# Altium schematic sheet VHDCI0_connector.SchDoc: VHDCI 0
size 420 x 297 mm; Author: G.K.; CompanyName: WUT; DrawnBy: G.K.; Organization: CERN; Address1: Warsaw Univeristy of Technology; Address2: Nowowiejska 15/19; DocumentNumber: 4; Revision: -; SheetNumber: 4; SheetTotal: 10; EDA_Number: ARTIQ; Projet: Banker; ModifiedBy: -; CreateDate: XX/XX/XXXX; CheckedDate: -; Title2: Connector & driver; DivGrp: ISE; Designer: G.K.; ModifiedDate: -; ProjectName: ADC/DAC MEZZANINE
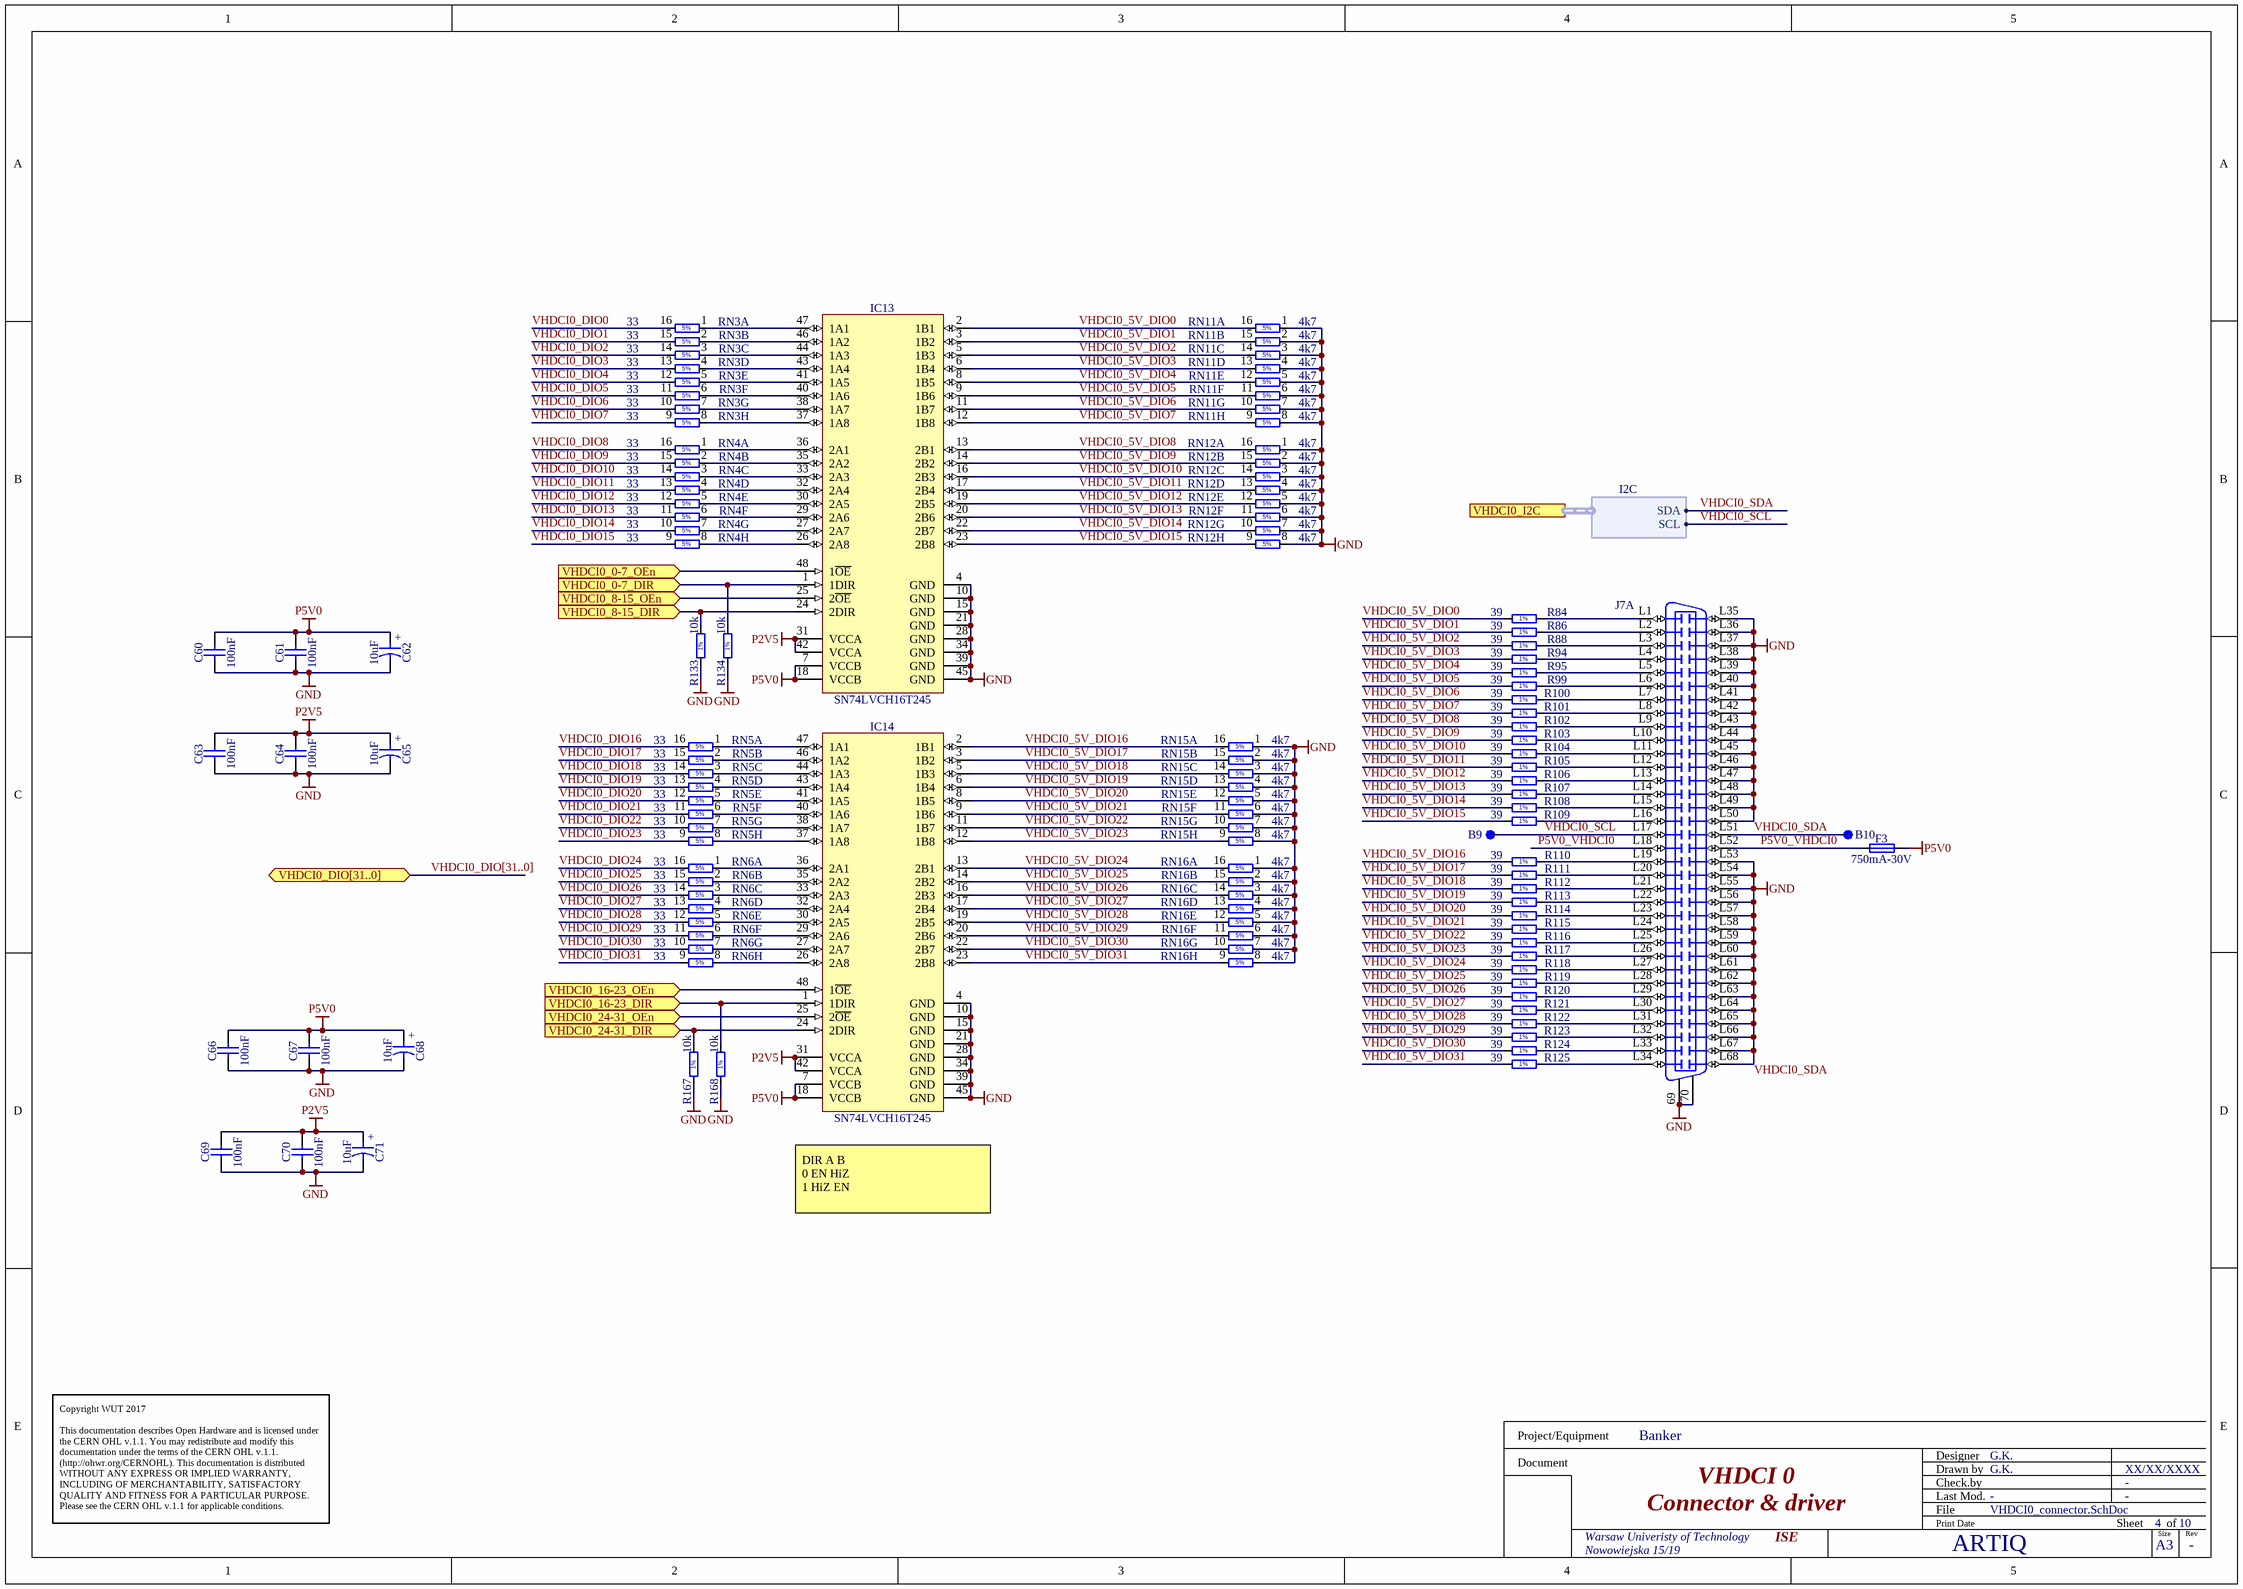
[diagram p0: VHDCI0_connector.SchDoc]

## Parts
B9  SMD Pad  [C100]  (value not drawn)
B10  SMD Pad  [C100]  (value not drawn)
C60  100nF  [CAPC1005X55N]
C61  100nF  [CAPC1005X55N]
C62  10uF  [CAPAE430X540N]
C63  100nF  [CAPC1005X55N]
C64  100nF  [CAPC1005X55N]
C65  10uF  [CAPAE430X540N]
C66  100nF  [CAPC1005X55N]
C67  100nF  [CAPC1005X55N]
C68  10uF  [CAPAE430X540N]
C69  100nF  [CAPC1005X55N]
C70  100nF  [CAPC1005X55N]
C71  10uF  [CAPAE430X540N]
F3  750mA-30V  [FUSR_BOURNS_MF-SM075]
IC13  SN74LVCH16T245  [SOP50P810X120-48N]
IC14  SN74LVCH16T245  [SOP50P810X120-48N]
J7  VHDCI  [MOLEX_74337-0015]  (value not drawn)  (part A of 2)
R84  39  [RESC2012X60N]
R86  39  [RESC2012X60N]
R88  39  [RESC2012X60N]
R94  39  [RESC2012X60N]
R95  39  [RESC2012X60N]
R99  39  [RESC2012X60N]
R100  39  [RESC2012X60N]
R101  39  [RESC2012X60N]
R102  39  [RESC2012X60N]
R103  39  [RESC2012X60N]
R104  39  [RESC2012X60N]
R105  39  [RESC2012X60N]
R106  39  [RESC2012X60N]
R107  39  [RESC2012X60N]
R108  39  [RESC2012X60N]
R109  39  [RESC2012X60N]
R110  39  [RESC2012X60N]
R111  39  [RESC2012X60N]
R112  39  [RESC2012X60N]
R113  39  [RESC2012X60N]
R114  39  [RESC2012X60N]
R115  39  [RESC2012X60N]
R116  39  [RESC2012X60N]
R117  39  [RESC2012X60N]
R118  39  [RESC2012X60N]
R119  39  [RESC2012X60N]
R120  39  [RESC2012X60N]
R121  39  [RESC2012X60N]
R122  39  [RESC2012X60N]
R123  39  [RESC2012X60N]
R124  39  [RESC2012X60N]
R125  39  [RESC2012X60N]
R133  10k  [RESC1005X40N]
R134  10k  [RESC1005X40N]
R167  10k  [RESC1005X40N]
R168  10k  [RESC1005X40N]
RN3  33  [RN_YAGEO_YC248]  (parts A,B,C,D,E,F,G,H of 8)
RN4  33  [RN_YAGEO_YC248]  (parts A,B,C,D,E,F,G,H of 8)
RN5  33  [RN_YAGEO_YC248]  (parts A,B,C,D,E,F,G,H of 8)
RN6  33  [RN_YAGEO_YC248]  (parts A,B,C,D,E,F,G,H of 8)
RN11  4k7  [RN_YAGEO_YC248]  (parts A,B,C,D,E,F,G,H of 8)
RN12  4k7  [RN_YAGEO_YC248]  (parts A,B,C,D,E,F,G,H of 8)
RN15  4k7  [RN_YAGEO_YC248]  (parts A,B,C,D,E,F,G,H of 8)
RN16  4k7  [RN_YAGEO_YC248]  (parts A,B,C,D,E,F,G,H of 8)

## Ports
VHDCI0_0-7_DIR (in), VHDCI0_0-7_OEn (in), VHDCI0_8-15_DIR (in), VHDCI0_8-15_OEn (in), VHDCI0_16-23_DIR (in), VHDCI0_16-23_OEn (in), VHDCI0_24-31_DIR (in), VHDCI0_24-31_OEn (in), VHDCI0_DIO[31..0] (bidir), VHDCI0_I2C (harness I2C)

## Harnesses
I2C: SDA, SCL

## Nets
GND: C60.1 C61.1 C62.2 C63.1 C64.1 C65.2 C66.1 C67.1 C68.2 C69.1 C70.1 C71.2 IC13.4(GND) IC13.10(GND) IC13.15(GND) IC13.21(GND) IC13.28(GND) IC13.34(GND) IC13.39(GND) IC13.45(GND) IC14.4(GND) IC14.10(GND) IC14.15(GND) IC14.21(GND) IC14.28(GND) IC14.34(GND) IC14.39(GND) IC14.45(GND) J7.69 J7.70 J7.L35 J7.L36 J7.L37 J7.L38 J7.L39 J7.L40 J7.L41 J7.L42 J7.L43 J7.L44 J7.L45 J7.L46 J7.L47 J7.L48 J7.L49 J7.L50 J7.L53 J7.L54 J7.L55 J7.L56 J7.L57 J7.L58 J7.L59 J7.L60 J7.L61 J7.L62 J7.L63 J7.L64 J7.L65 J7.L66 J7.L67 J7.L68 R133.1 R134.1 R167.1 R168.1 RN11.1 RN11.2 RN11.3 RN11.4 RN11.5 RN11.6 RN11.7 RN11.8 RN12.1 RN12.2 RN12.3 RN12.4 RN12.5 RN12.6 RN12.7 RN12.8 RN15.1 RN15.2 RN15.3 RN15.4 RN15.5 RN15.6 RN15.7 RN15.8 RN16.1 RN16.2 RN16.3 RN16.4 RN16.5 RN16.6 RN16.7 RN16.8
P2V5: C63.2 C64.2 C65.1 C69.2 C70.2 C71.1 IC13.31(VCCA) IC13.42(VCCA) IC14.31(VCCA) IC14.42(VCCA)
P5V0: C60.2 C61.2 C62.1 C66.2 C67.2 C68.1 F3.2 IC13.7(VCCB) IC13.18(VCCB) IC14.7(VCCB) IC14.18(VCCB)
P5V0_VHDCI0: F3.1 J7.L18 J7.L52
VHDCI0_0-7_DIR: IC13.1(1DIR) R134.2 ; port VHDCI0_0-7_DIR
VHDCI0_0-7_OEn: IC13.48(1~{OE}) ; port VHDCI0_0-7_OEn
VHDCI0_5V_DIO0: IC13.2(1B1) R84.1 RN11.16
VHDCI0_5V_DIO1: IC13.3(1B2) R86.1 RN11.15
VHDCI0_5V_DIO2: IC13.5(1B3) R88.1 RN11.14
VHDCI0_5V_DIO3: IC13.6(1B4) R94.1 RN11.13
VHDCI0_5V_DIO4: IC13.8(1B5) R95.1 RN11.12
VHDCI0_5V_DIO5: IC13.9(1B6) R99.1 RN11.11
VHDCI0_5V_DIO6: IC13.11(1B7) R100.1 RN11.10
VHDCI0_5V_DIO7: IC13.12(1B8) R101.1 RN11.9
VHDCI0_5V_DIO8: IC13.13(2B1) R102.1 RN12.16
VHDCI0_5V_DIO9: IC13.14(2B2) R103.1 RN12.15
VHDCI0_5V_DIO10: IC13.16(2B3) R104.1 RN12.14
VHDCI0_5V_DIO11: IC13.17(2B4) R105.1 RN12.13
VHDCI0_5V_DIO12: IC13.19(2B5) R106.1 RN12.12
VHDCI0_5V_DIO13: IC13.20(2B6) R107.1 RN12.11
VHDCI0_5V_DIO14: IC13.22(2B7) R108.1 RN12.10
VHDCI0_5V_DIO15: IC13.23(2B8) R109.1 RN12.9
VHDCI0_5V_DIO16: IC14.2(1B1) R110.1 RN15.16
VHDCI0_5V_DIO17: IC14.3(1B2) R111.1 RN15.15
VHDCI0_5V_DIO18: IC14.5(1B3) R112.1 RN15.14
VHDCI0_5V_DIO19: IC14.6(1B4) R113.1 RN15.13
VHDCI0_5V_DIO20: IC14.8(1B5) R114.1 RN15.12
VHDCI0_5V_DIO21: IC14.9(1B6) R115.1 RN15.11
VHDCI0_5V_DIO22: IC14.11(1B7) R116.1 RN15.10
VHDCI0_5V_DIO23: IC14.12(1B8) R117.1 RN15.9
VHDCI0_5V_DIO24: IC14.13(2B1) R118.1 RN16.16
VHDCI0_5V_DIO25: IC14.14(2B2) R119.1 RN16.15
VHDCI0_5V_DIO26: IC14.16(2B3) R120.1 RN16.14
VHDCI0_5V_DIO27: IC14.17(2B4) R121.1 RN16.13
VHDCI0_5V_DIO28: IC14.19(2B5) R122.1 RN16.12
VHDCI0_5V_DIO29: IC14.20(2B6) R123.1 RN16.11
VHDCI0_5V_DIO30: IC14.22(2B7) R124.1 RN16.10
VHDCI0_5V_DIO31: IC14.23(2B8) R125.1 RN16.9
VHDCI0_8-15_DIR: IC13.24(2DIR) R133.2 ; port VHDCI0_8-15_DIR
VHDCI0_8-15_OEn: IC13.25(2~{OE}) ; port VHDCI0_8-15_OEn
VHDCI0_16-23_DIR: IC14.1(1DIR) R168.2 ; port VHDCI0_16-23_DIR
VHDCI0_16-23_OEn: IC14.48(1~{OE}) ; port VHDCI0_16-23_OEn
VHDCI0_24-31_DIR: IC14.24(2DIR) R167.2 ; port VHDCI0_24-31_DIR
VHDCI0_24-31_OEn: IC14.25(2~{OE}) ; port VHDCI0_24-31_OEn
VHDCI0_DIO0: RN3.16
VHDCI0_DIO1: RN3.15
VHDCI0_DIO2: RN3.14
VHDCI0_DIO3: RN3.13
VHDCI0_DIO4: RN3.12
VHDCI0_DIO5: RN3.11
VHDCI0_DIO6: RN3.10
VHDCI0_DIO7: RN3.9
VHDCI0_DIO8: RN4.16
VHDCI0_DIO9: RN4.15
VHDCI0_DIO10: RN4.14
VHDCI0_DIO11: RN4.13
VHDCI0_DIO12: RN4.12
VHDCI0_DIO13: RN4.11
VHDCI0_DIO14: RN4.10
VHDCI0_DIO15: RN4.9
VHDCI0_DIO16: RN5.16
VHDCI0_DIO17: RN5.15
VHDCI0_DIO18: RN5.14
VHDCI0_DIO19: RN5.13
VHDCI0_DIO20: RN5.12
VHDCI0_DIO21: RN5.11
VHDCI0_DIO22: RN5.10
VHDCI0_DIO23: RN5.9
VHDCI0_DIO24: RN6.16
VHDCI0_DIO25: RN6.15
VHDCI0_DIO26: RN6.14
VHDCI0_DIO27: RN6.13
VHDCI0_DIO28: RN6.12
VHDCI0_DIO29: RN6.11
VHDCI0_DIO30: RN6.10
VHDCI0_DIO31: RN6.9
VHDCI0_SCL: B9.1 J7.L17 ; port VHDCI0_I2C.SCL
VHDCI0_SDA: B10.1 J7.L51 ; port VHDCI0_I2C.SDA
NetIC13_26: IC13.26(2A8) RN4.8
NetIC13_27: IC13.27(2A7) RN4.7
NetIC13_29: IC13.29(2A6) RN4.6
NetIC13_30: IC13.30(2A5) RN4.5
NetIC13_32: IC13.32(2A4) RN4.4
NetIC13_33: IC13.33(2A3) RN4.3
NetIC13_35: IC13.35(2A2) RN4.2
NetIC13_36: IC13.36(2A1) RN4.1
NetIC13_37: IC13.37(1A8) RN3.8
NetIC13_38: IC13.38(1A7) RN3.7
NetIC13_40: IC13.40(1A6) RN3.6
NetIC13_41: IC13.41(1A5) RN3.5
NetIC13_43: IC13.43(1A4) RN3.4
NetIC13_44: IC13.44(1A3) RN3.3
NetIC13_46: IC13.46(1A2) RN3.2
NetIC13_47: IC13.47(1A1) RN3.1
NetIC14_26: IC14.26(2A8) RN6.8
NetIC14_27: IC14.27(2A7) RN6.7
NetIC14_29: IC14.29(2A6) RN6.6
NetIC14_30: IC14.30(2A5) RN6.5
NetIC14_32: IC14.32(2A4) RN6.4
NetIC14_33: IC14.33(2A3) RN6.3
NetIC14_35: IC14.35(2A2) RN6.2
NetIC14_36: IC14.36(2A1) RN6.1
NetIC14_37: IC14.37(1A8) RN5.8
NetIC14_38: IC14.38(1A7) RN5.7
NetIC14_40: IC14.40(1A6) RN5.6
NetIC14_41: IC14.41(1A5) RN5.5
NetIC14_43: IC14.43(1A4) RN5.4
NetIC14_44: IC14.44(1A3) RN5.3
NetIC14_46: IC14.46(1A2) RN5.2
NetIC14_47: IC14.47(1A1) RN5.1
NetJ7_L1: J7.L1 R84.2
NetJ7_L2: J7.L2 R86.2
NetJ7_L3: J7.L3 R88.2
NetJ7_L4: J7.L4 R94.2
NetJ7_L5: J7.L5 R95.2
NetJ7_L6: J7.L6 R99.2
NetJ7_L7: J7.L7 R100.2
NetJ7_L8: J7.L8 R101.2
NetJ7_L9: J7.L9 R102.2
NetJ7_L10: J7.L10 R103.2
NetJ7_L11: J7.L11 R104.2
NetJ7_L12: J7.L12 R105.2
NetJ7_L13: J7.L13 R106.2
NetJ7_L14: J7.L14 R107.2
NetJ7_L15: J7.L15 R108.2
NetJ7_L16: J7.L16 R109.2
NetJ7_L19: J7.L19 R110.2
NetJ7_L20: J7.L20 R111.2
NetJ7_L21: J7.L21 R112.2
NetJ7_L22: J7.L22 R113.2
NetJ7_L23: J7.L23 R114.2
NetJ7_L24: J7.L24 R115.2
NetJ7_L25: J7.L25 R116.2
NetJ7_L26: J7.L26 R117.2
NetJ7_L27: J7.L27 R118.2
NetJ7_L28: J7.L28 R119.2
NetJ7_L29: J7.L29 R120.2
NetJ7_L30: J7.L30 R121.2
NetJ7_L31: J7.L31 R122.2
NetJ7_L32: J7.L32 R123.2
NetJ7_L33: J7.L33 R124.2
NetJ7_L34: J7.L34 R125.2

## Buses and harness runs
bus VHDCI0_DIO[31..0] = port VHDCI0_DIO[31..0]

## Notes on the sheet
- (near IC14) DIR	A	B
  0	EN	HiZ
  1	HiZ	EN
- Copyright WUT 2017
  This documentation describes Open Hardware and is licensed under the CERN OHL v.1.1. You may redistribute and modify this documentation under the terms of the CERN OHL v.1.1. (http://ohwr.org/CERNOHL). This documentation is distributed WITHOUT ANY EXPRESS OR IMPLIED WARRANTY, INCLUDING OF MERCHANTABILITY, SATISFACTORY QUALITY AND FITNESS FOR A PARTICULAR PURPOSE. Please see the CERN OHL v.1.1 for applicable conditions.
- Labels drawn without touching a wire or pin: VHDCI0_SDA
- Project/Equipment
- Document
- Designer
- Drawn by
- Check.by
- File
- Last Mod.
- Print Date
- Sheet
- Size
- A3
- of
- Rev
- (in symbol CAE430-540_10UF_16V_20%) +
- (in symbol R0402_10K_1%_0.0625W_100PPM) 1%
- (in symbol R0805_39R_1%_0.125W_100PPM) 1%
- (in symbol RES_RN_4K7_YAGEO_YC248-JR-074K7L, part A) 5%
- (in symbol RES_RN_4K7_YAGEO_YC248-JR-074K7L, part B) 5%
- (in symbol RES_RN_4K7_YAGEO_YC248-JR-074K7L, part C) 5%
- (in symbol RES_RN_4K7_YAGEO_YC248-JR-074K7L, part D) 5%
- (in symbol RES_RN_4K7_YAGEO_YC248-JR-074K7L, part E) 5%
- (in symbol RES_RN_4K7_YAGEO_YC248-JR-074K7L, part F) 5%
- (in symbol RES_RN_4K7_YAGEO_YC248-JR-074K7L, part G) 5%
- (in symbol RES_RN_4K7_YAGEO_YC248-JR-074K7L, part H) 5%
- (in symbol RN_33R_YAGEO_YC248-JR-0733RL, part A) 5%
- (in symbol RN_33R_YAGEO_YC248-JR-0733RL, part B) 5%
- (in symbol RN_33R_YAGEO_YC248-JR-0733RL, part C) 5%
- (in symbol RN_33R_YAGEO_YC248-JR-0733RL, part D) 5%
- (in symbol RN_33R_YAGEO_YC248-JR-0733RL, part E) 5%
- (in symbol RN_33R_YAGEO_YC248-JR-0733RL, part F) 5%
- (in symbol RN_33R_YAGEO_YC248-JR-0733RL, part G) 5%
- (in symbol RN_33R_YAGEO_YC248-JR-0733RL, part H) 5%

## Library data of the parts
B9 B10 = SMD_PAD_D1MM: Through Hole Pad; Part Description: 1mm Diameter SMD Pad; Mounted: No; Part Number: SMD_PAD_D1MM; Component Kind: Standard (No BOM); Component Type: Standard (No BOM); Pin Count: 1; Family: SMD Pad; Socket: No; SMD: No; Sense: No; Status: None; ComponentHeight: 0mm; HelpURL: Undefined; Author: CERN DEM JLC; CreateDate: 10.10.2017; LatestRevisionDate: 10.10.2017; PackageDescription: 1mm Diameter SMD Pad
C60 C61 C63 C64 C66 C67 C69 C70 = CC0402_100NF_16V_10%_X5R: Non-polarised capacitor; Part Description: SMD Multilayer Chip Ceramic Capacitor; Manufacturer: GENERIC; Manufacturer1 Part Number: GRM155R61C104KA88D; Voltage: 16V; TC: X5R; Tolerance: ±10%; Part Number: CC0402_100NF_16V_10%_X5R; Component Kind: Standard; Component Type: Standard; Pin Count: 2; Value: 100nF; Status: None; Manufacturer Part Number: CC0402_100NF_16V_10%_X5R; Case: 0402; Mounted: Yes; Socket: No; SMD: Yes; Sense: No; Manufacturer1 Example: MURATA; Manufacturer1 ComponentHeight: 0.55mm; HelpURL: \\cern.ch\dfs\Applications\Altium\Datasheets\CC0402_X5R_MURATA_GRM.pdf; Author: CERN DEM JLC; CreateDate: 10.12.2013; LatestRevisionDate: 10.12.2013
C62 C65 C68 C71 = CAE430-540_10UF_16V_20%: Polarised capacitor; Part Description: Aluminum Electrolytic SMT Capacitor; Manufacturer: PANASONIC; Manufacturer Part Number: EEEFK1C100AR; Voltage: 16V; Tolerance: ±20%; Part Number: CAE430-540_10UF_16V_20%; Component Kind: Standard; Component Type: Standard; Pin Count: 2; Value: 10uF; Status: Not Recommended; Case: B; Mounted: Yes; Socket: No; SMD: Yes; Sense: No; ComponentHeight: 5.8mm; HelpURL: \\cern.ch\dfs\Applications\Altium\Datasheets\CAE_PANASONIC_FK.pdf; Author: CERN DEM JLC; CreateDate: 03.12.2007; LatestRevisionDate: 05.11.2014
F3 = FUSR_BOURNS_MF-SM075-2: Fuse; Part Description: PTC Resettable Fuse; Manufacturer: BOURNS; PressFit: No; Part Number: FUSR_BOURNS_MF-SM075-2; Component Kind: Standard; Component Type: Standard; Pin Count: 2; PackageDescription: PolySwitch, 2-Leads, Body 7.35x5.12mm Nominal; Family: Fuses Resettable; Mounted: Yes; Socket: No; SMD: Yes; Sense: No; Value: 750mA-30V; Manufacturer Part Number: MF-SM075-2; ComponentHeight: 3.18mm; HelpURL: \\cern.ch\dfs\Applications\Altium\Datasheets\FUSR_BOURNS_MF-SM075-2.pdf; Author: CERN DEM JLC; CreateDate: 01/03/2012; LatestRevisionDate: 07/11/2012
IC13 IC14 = 74LVCH16T245: 16-Bit Dual-Supply Bus Transceiver With Configurable Voltage Translation And 3-State Outputs; Part Number: SN74LVCH16T245DGGR; Part Description: 16-Bit Dual-Supply Bus Transceivers With Configurable Voltage Translation And 3-State Outputs; Manufacturer: TEXAS INSTRUMENTS; PressFit: No; Bonding: No; Component Kind: Standard; Component Type: Standard; Device: SN74LVCH16T245; PackageDescription: SOP, 48-Leads, Body 12.6x6.2mm (max), Pitch 0.50mm, IPC Medium Density; Manufacturer Part Number: SN74LVCH16T245DGGR; Pin Count: 48; Case: TSSOP48; Mounted: Yes; Socket: No; SMD: Yes; Sense: No; ComponentHeight: 1.2mm; Author: GK; HelpURL: \\cern.ch\dfs\Applications\Altium\Datasheets\CLVCH16T245MDGGREP.pdf; CreateDate: 09/02/2016; LatestRevisionDate: 09/02/2016
J7 = MOLEX_74337-0015: Very High Density Cable Interconnect (VHDCI ) 2x68 Female; Part Number: Delivered by GK; Part Description: 2x68 Positions, Pitch 0.8mm, Very Hight Density Right Angle Dual Stacked VHDCI Receptacle; Manufacturer: MOLEX; PressFit: No; Component Kind: Standard; Component Type: Standard; Pin Count: 140; Family: VHDCI; Mounted: Yes; Socket: No; SMD: No; Sense: No; Status: None; Manufacturer Part Number: Delivered by GK; ComponentHeight: 10.78mm; HelpURL: \\cern.ch\dfs\Applications\Altium\Datasheets\MOLEX_74337-0015.pdf; Author: CERN DEM JLC; CreateDate: 30.04.2014; LatestRevisionDate: 30.04.2014
R84 R86 R88 R94 R95 R99-R125 = R0805_39R_1%_0.125W_100PPM: Resistor - 1%; Part Description: General Purpose Thick Film Chip Resistor; Manufacturer: GENERIC; Manufacturer1 Part Number: NRC10F39R0TRF; Power: 0.125W; TC: ±100ppm/°C; PressFit: No; Part Number: R0805_39R_1%_0.125W_100PPM; Component Kind: Standard; Component Type: Standard; Pin Count: 2; Value: 39; Status: Preferred; Tolerance: ±1%; Manufacturer Part Number: R0805_39R_1%_0.125W_100PPM; Case: 0805; Mounted: Yes; Sense: No; Socket: No; SMD: Yes; Manufacturer1 Example: NIC COMPONENT; Manufacturer1 ComponentHeight: 0.6mm; HelpURL: \\cern.ch\dfs\Applications\Altium\Datasheets\R0805_NIC_NRC.pdf; Author: CERN DEM JLC; CreateDate: 03/12/2007; LatestRevisionDate: 13/03/2008
R133 R134 R167 R168 = R0402_10K_1%_0.0625W_100PPM: Resistor - 1%; Part Description: General Purpose Thick Film Chip Resistor; Manufacturer: GENERIC; Manufacturer1 Part Number: 232270671003L; TC: ±100ppm/°C; PressFit: No; Part Number: R0402_10K_1%_0.0625W_100PPM; Component Kind: Standard; Component Type: Standard; Pin Count: 2; Value: 10k; Status: Not Recommended; Power: 0.0625W; Tolerance: ±1%; Manufacturer Part Number: R0402_10K_1%_0.0625W_100PPM; Case: 0402; Mounted: Yes; Sense: No; Socket: No; SMD: Yes; Manufacturer1 Example: YAGEO PHYCOMP; Manufacturer1 ComponentHeight: 0.4mm; HelpURL: \\cern.ch\dfs\Applications\Altium\Datasheets\R0402_Phycomp_RC0402.pdf; Author: CERN DEM JLC; CreateDate: 03/12/2007; LatestRevisionDate: 17/10/2012
RN3-RN6 = RN_33R_YAGEO_YC248-JR-0733RL: DIL16 Resistor Network 8 Isolated Resistor 5%; Part Description: Chip Resistor Array , 8 Isolated Resistors (Side Convex Terminal), YC248 Series; Manufacturer: YAGEO; Power: 0.062W; PressFit: No; TC: ±200ppm/°C; Part Number: RN_33R_YAGEO_YC248-JR-0733RL; Component Kind: Standard; Component Type: Standard; Pin Count: 16; Value: 33; Sense: No; Tolerance: ±5%; Manufacturer Part Number: YC248-JR-0733RL; Mounted: Yes; Socket: No; SMD: Yes; ComponentHeight: 0.55mm; HelpURL: \\cern.ch\dfs\Applications\Altium\Datasheets\RN_YAGEO_YC248.pdf; Author: CERN DEM JLC; CreateDate: 13/01/2011; LatestRevisionDate: 13/01/2011
RN11 RN12 RN15 RN16 = RES_RN_4K7_YAGEO_YC248-JR-074K7L: 8x Resistor Network  Isolated Resistor 5%; Part Number: RN_33R_YAGEO_YC248-JR-074K7L; Part Description: Chip Resistor Array , 8 Isolated Resistors (Side Convex Terminal), YC248 Series; Manufacturer: YAGEO; Power: 0.062W; PressFit: No; TC: ±200ppm/°C; Component Kind: Standard; Component Type: Standard; Pin Count: 16; Value: 4k7; Sense: No; Tolerance: ±5%; Manufacturer Part Number: YC248-JR-074K7L; Mounted: Yes; Socket: No; SMD: Yes; ComponentHeight: 0.55mm; HelpURL: \\cern.ch\dfs\Applications\Altium\Datasheets\RN_YAGEO_YC248.pdf; Author: GK; CreateDate: 13/01/2011; LatestRevisionDate: 13/01/2011